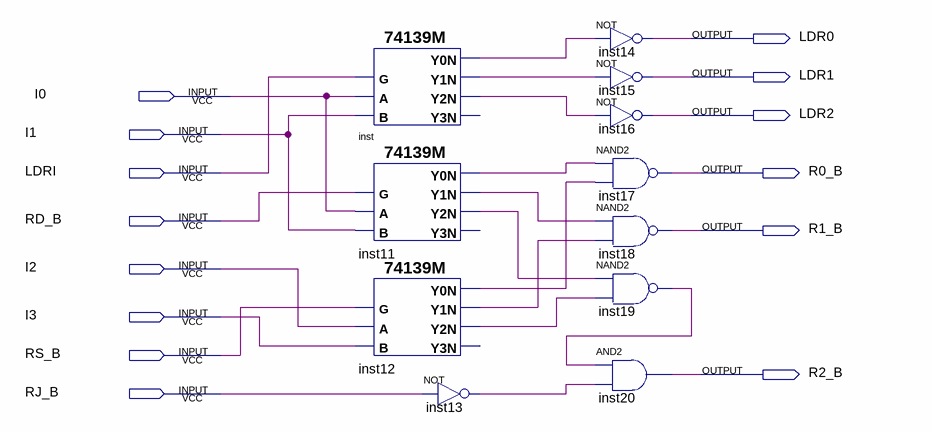
[diagram p0: schematic sheet]
// Quartus schematic shiyan3.bdf as structural Verilog: 11 symbols, 14 pins
module shiyan3 (
  input  I0,
  input  I1,
  input  LDRI,
  input  RD_B,
  input  I2,
  input  I3,
  input  RS_B,
  input  RJ_B,
  output LDR0,
  output LDR1,
  output LDR2,
  output R0_B,
  output R1_B,
  output R2_B
);

  wire inst11_y0n, inst11_y1n, inst11_y2n, inst12_y0n, inst12_y1n, inst12_y2n, inst13_out, inst19_out,
       inst_y0n, inst_y1n, inst_y2n;

  \74139M  inst (.B(I1), .A(I0), .G(LDRI), .Y2N(inst_y2n), .Y0N(inst_y0n), .Y1N(inst_y1n));  // open: Y3N
  \74139M  inst11 (.B(I1), .A(I0), .G(RD_B), .Y2N(inst11_y2n), .Y0N(inst11_y0n), .Y1N(inst11_y1n));  // open: Y3N
  \74139M  inst12 (.B(I3), .A(I2), .G(RS_B), .Y2N(inst12_y2n), .Y0N(inst12_y0n), .Y1N(inst12_y1n));  // open: Y3N
  not inst13 (inst13_out, RJ_B);
  not inst14 (LDR0, inst_y0n);
  not inst15 (LDR1, inst_y1n);
  not inst16 (LDR2, inst_y2n);
  nand inst17 (R0_B, inst11_y0n, inst12_y0n);
  nand inst18 (R1_B, inst11_y1n, inst12_y1n);
  nand inst19 (inst19_out, inst11_y2n, inst12_y2n);
  and inst20 (R2_B, inst19_out, inst13_out);
endmodule
